# Altium schematic sheet Sheet3.SchDoc
size A4
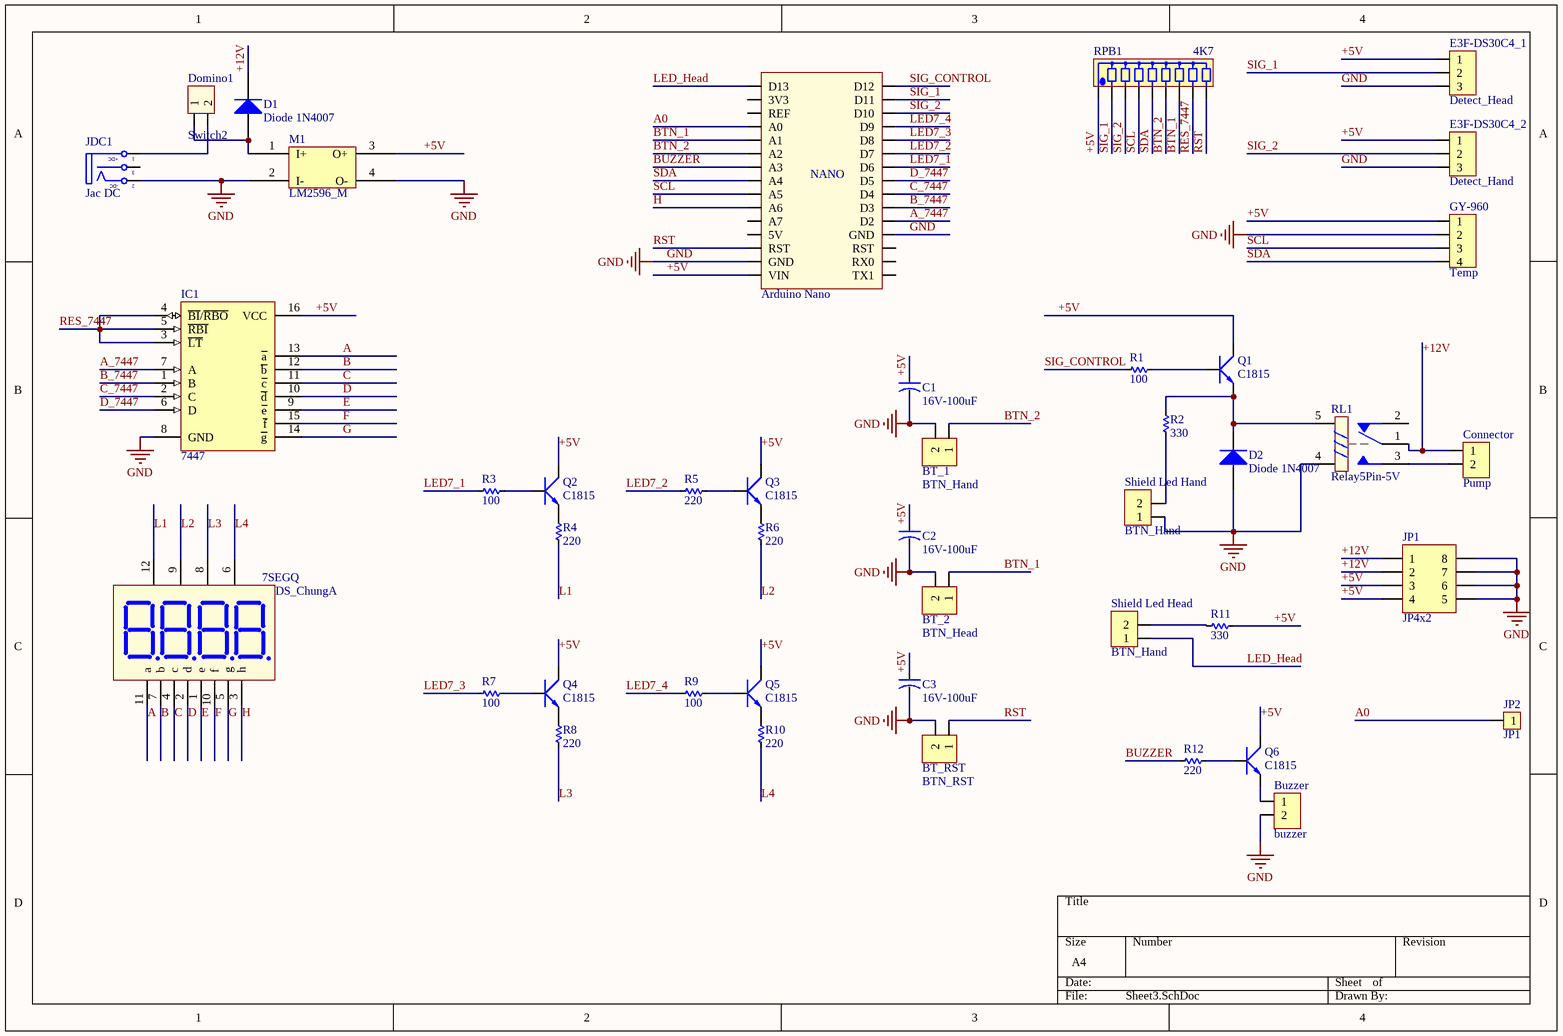
[diagram p0: Sheet3.SchDoc]

## Parts
Arduino_Nano  Arduino Nano  [Arduino Nano]  (value not drawn)
BT_1  BTN_Hand  [Header2]
BT_2  BTN_Head  [Header2]
BT_RST  BTN_RST  [Header2]
Buzzer  buzzer  [Header2]
C1  16V-100uF  [CA-ALU-2.54]
C2  16V-100uF  [CA-ALU-2.54]
C3  16V-100uF  [CA-ALU-2.54]
Connector  Pump  [Header2]
D1  Diode 1N4007  [DO-41]
D2  Diode 1N4007  [DO-41]
Domino1  Switch2  [HED2]
DS_ChungA  7SEGQ  [LED7SEG-4-0.36]
E3F-DS30C4_1  Detect_Head  [Header3]
E3F-DS30C4_2  Detect_Hand  [Header3]
GY-960  Temp  [Header4]
IC1  7447  [DIP16]
JDC1  Jac DC  [DC-IN]
JP1  JP4x2  [JP4-C2T]
JP2  JP1  [JP1-D1T]
M1  LM2596_M  [LM2596_M]
Q1  C1815  [QTO-92]
Q2  C1815  [QTO-92]
Q3  C1815  [QTO-92]
Q4  C1815  [QTO-92]
Q5  C1815  [QTO-92]
Q6  C1815  [QTO-92]
R1  100  [RES-1/2W]
R2  330  [RES-1/2W]
R3  100  [RES-1/2W]
R4  220  [RES-1/2W]
R5  220  [RES-1/2W]
R6  220  [RES-1/2W]
R7  100  [RES-1/2W]
R8  220  [RES-1/2W]
R9  100  [RES-1/2W]
R10  220  [RES-1/2W]
R11  330  [RES-1/2W]
R12  220  [RES-1/2W]
RL1  Relay5Pin-5V  [RL_SPDT_10A]
RPB1  4K7  [RN8]
Shield_Led_Hand  BTN_Hand  [Header2]
Shield_Led_Head  BTN_Hand  [Header2]

## Nets
GND: Arduino_Nano.GND BT_1.2 BT_2.2 BT_RST.2 Buzzer.2 C1.2 C2.2 C3.2 D2.1(A) E3F-DS30C4_1.3 E3F-DS30C4_2.3 GY-960.2 IC1.8(GND) JDC1.2(TN) JP1.5 JP1.6 JP1.7 JP1.8 M1.2(I-) M1.4(O-) RL1.4 Shield_Led_Hand.1
+5V: Arduino_Nano.VIN C1.1 C2.1 C3.1 E3F-DS30C4_1.1 E3F-DS30C4_2.1 GY-960.1 IC1.16(VCC) JP1.3 JP1.4 M1.3(O+) Q1.2(C) Q2.2(C) Q3.2(C) Q4.2(C) Q5.2(C) Q6.2(C) R11.2 RPB1.1
+12V: Connector.1 D1.2(K) JP1.1 JP1.2 RL1.1
A: DS_ChungA.11(a) IC1.13(~{a})
A0: Arduino_Nano.A0 JP2.1
A_7447: Arduino_Nano.D2 IC1.7(A)
B: DS_ChungA.7(b) IC1.12(~{b})
B_7447: Arduino_Nano.D3 IC1.1(B)
BTN_1: Arduino_Nano.A1 BT_2.1 RPB1.7
BTN_2: Arduino_Nano.A2 BT_1.1 RPB1.6
BUZZER: Arduino_Nano.A3 R12.2
C: DS_ChungA.4(c) IC1.11(~{c})
C_7447: Arduino_Nano.D4 IC1.2(C)
D: DS_ChungA.2(d) IC1.10(~{d})
D_7447: Arduino_Nano.D5 IC1.6(D)
E: DS_ChungA.1(e) IC1.9(~{e})
F: DS_ChungA.10(f) IC1.15(~{f})
G: DS_ChungA.5(g) IC1.14(~{g})
H: Arduino_Nano.A6 DS_ChungA.3(h)
L1: DS_ChungA.12(V1) R4.2
L2: DS_ChungA.9(V2) R6.2
L3: DS_ChungA.8(V3) R8.2
L4: DS_ChungA.6(V4) R10.2
LED7_1: Arduino_Nano.D6 R3.2
LED7_2: Arduino_Nano.D7 R5.2
LED7_3: Arduino_Nano.D8 R7.1
LED7_4: Arduino_Nano.D9 R9.1
LED_Head: Arduino_Nano.D13 Shield_Led_Head.1
RES_7447: IC1.3(~{LT}) IC1.4(~{BI}/~{RBO}) IC1.5(~{RBI}) RPB1.8
RST: Arduino_Nano.RST BT_RST.1 RPB1.9
SCL: Arduino_Nano.A5 GY-960.3 RPB1.4
SDA: Arduino_Nano.A4 GY-960.4 RPB1.5
SIG_1: Arduino_Nano.D11 E3F-DS30C4_1.2 RPB1.2
SIG_2: Arduino_Nano.D10 E3F-DS30C4_2.2 RPB1.3
SIG_CONTROL: Arduino_Nano.D12 R1.1
NetBuzzer_1: Buzzer.1 Q6.1(E)
NetConnector_2: Connector.2 RL1.3
NetD1_1: D1.1(A) Domino1.1 M1.1(I+)
NetD2_2: D2.2(K) Q1.1(E) R2.1 RL1.5
NetDomino1_2: Domino1.2 JDC1.1(T)
NetQ1_3: Q1.3(B) R1.2
NetQ2_1: Q2.1(E) R4.1
NetQ2_3: Q2.3(B) R3.1
NetQ3_1: Q3.1(E) R6.1
NetQ3_3: Q3.3(B) R5.1
NetQ4_1: Q4.1(E) R8.1
NetQ4_3: Q4.3(B) R7.2
NetQ5_1: Q5.1(E) R10.1
NetQ5_3: Q5.3(B) R9.2
NetQ6_3: Q6.3(B) R12.1
NetR2_2: R2.2 Shield_Led_Hand.2
NetR11_1: R11.1 Shield_Led_Head.2

Not connected (* = marked no-connect by the designer): Arduino_Nano 3V3 5V A7 REF RX0 TX1; JDC1 3(S); RL1 2

## Notes on the sheet
- (in symbol Arduino Nano) NANO
- (in symbol DCIN) +DC; -DC

## Library data of the parts
Arduino_Nano = Arduino Nano: Value: Cau 1A
BT_1 BT_2 BT_RST Buzzer Connector Shield_Led_Hand Shield_Led_Head = Header2: Header IDC, 2 x 1 Pin Vertical 2.54mm Pitch (Non-Boxed, Male); Manufacturer: W¨¹rth Elektronik eiSos GmbH; partNo: 613002143121; ComponentLink1 Description: Manufacturer; ComponentLink2 Description: Datasheet; NoPins: 02; Created Date: 29 March 2013; ComponentLink1URL: http://www.we-online.com; ComponentLink2URL: http://katalog.we-online.de/em/datasheet/6130xx143121.pdf; Created by: Karrer Zheng
C1-C3 = CN-ALU-DIP: Capacitor (Semiconductor SIM Model); Value: 104; LatestRevisionDate: 17-Jul-2002; LatestRevisionNote: Re-released for DXP Platform.; PackageReference: C1206; Publisher: Altium Limited
D1 D2 = Diode 1N4007: 1 Amp General Purpose Rectifier; Published: 8-Jun-2000; LatestRevisionDate: 17-Jul-2002; LatestRevisionNote: Re-released for DXP Platform.; DatasheetVersion: 1998; PackageVersion: Aug-1999; PackageReference: DO-41; Publisher: Altium Limited; PackageDescription: Diode, Axial; Body 5.2 x 2.7 mm (LxDia. max), Lead Dia. 0.86 mm (max); Code_JEDEC: DO-204-AL; ComponentLink1Description: Manufacturer Link; ComponentLink1URL: http://www.fairchildsemi.com/; ComponentLink2Description: Datasheet; ComponentLink2URL: http://www.fairchildsemi.com/ds/1N%2F1N4001.pdf
Domino1 = Hed2: Header 2 (Green); Value: Header 2
DS_ChungA = LED7SEG-4: Four 7 Seg Dipslay; Value: LED 7Q SEG
E3F-DS30C4_1 E3F-DS30C4_2 = Header3: Header IDC, 3 x 1 Pin Vertical 2.54mm Pitch (Non-Boxed, Male); Manufacturer: W¨¹rth Elektronik eiSos GmbH; partNo: 613002143121; ComponentLink1 Description: Manufacturer; ComponentLink2 Description: Datasheet; NoPins: 02; Created Date: 29 March 2013; ComponentLink1URL: http://www.we-online.com; ComponentLink2URL: http://katalog.we-online.de/em/datasheet/6130xx143121.pdf; Created by: Karrer Zheng
GY-960 = Header4: Header IDC, 4 x 1 Pin Vertical 2.54mm Pitch (Non-Boxed, Male); Manufacturer: W¨¹rth Elektronik eiSos GmbH; partNo: 613002143121; ComponentLink1 Description: Manufacturer; ComponentLink2 Description: Datasheet; NoPins: 02; Created Date: 29 March 2013; ComponentLink1URL: http://www.we-online.com; ComponentLink2URL: http://katalog.we-online.de/em/datasheet/6130xx143121.pdf; Created by: Karrer Zheng
IC1 = 7447: BCD to 7-Segment Decoder/Driver; Value: 7447 , 74247
JDC1 = DCIN: Jac DC input; Value: Jac DC
JP1 = JP4x2: WR-PHD 2.54 mm Dual Socket Header; Manufacturer: W¨¹rth Elektronik eiSos GmbH; partNo: 61300821821; ComponentLink1 Description: Manufacturer; ComponentLink2 Description: Datasheet; NoPins: 08; Created Date: 29 March 2013; ComponentLink1URL: http://www.we-online.com; ComponentLink2URL: http://katalog.we-online.de/em/datasheet/6130xx21821.pdf; Created by: Karrer Zheng
JP2 = JP1: WR-PHD 2.54 mm Angled Socket Header; Manufacturer: W¨¹rth Elektronik eiSos GmbH; partNo: 613002143121; ComponentLink1 Description: Manufacturer; ComponentLink2 Description: Datasheet; NoPins: 02; Created Date: 29 March 2013; ComponentLink1URL: http://www.we-online.com; ComponentLink2URL: http://katalog.we-online.de/em/datasheet/6130xx143121.pdf; Created by: Karrer Zheng
M1 = LM2596_M: module nguon lm2596; Value: Jac DC
Q1-Q6 = C1815: NPN 600mW, ECB; Value: C1815
R1-R12 = Res: Manufacturer: Generic Components; Class: Passive; SubClass: R; Published: 08/06/2000; Publisher: Altium Hobart Technology Centre
RL1 = Relay 1: Relay SPDT,10A - 12VDC 5 Pin; Value: Relay SPDT, 10A, 12V
RPB1 = RN8: Resistor 8 (Thanh); Value: Tro thanh 10K